# EAGLE design encoder_se (EAGLE 6.2)
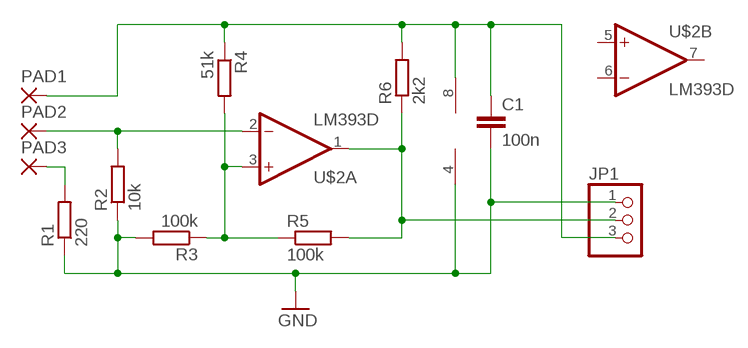
[diagram p0: schematic, sheet 1]

## Parts
C1  100n  C-EUC1206  [C1206]
JP1  PINHD-1X3/90  [1X03/90]
PAD1  SMD2  [SMD1,27-2,54]
PAD2  SMD2  [SMD1,27-2,54]
PAD3  SMD2  [SMD1,27-2,54]
R1  220  R-EU_M1206  [M1206]
R2  10k  R-EU_M1206  [M1206]
R3  100k  R-EU_M1206  [M1206]
R4  51k  R-EU_M1206  [M1206]
R5  100k  R-EU_M1206  [M1206]
R6  2k2  R-EU_M1206  [M1206]
U$2  LM393D  [SO08]

## Nets
GND: C1.2 JP1.1 R1.1 R2.1 R3.2 U$2.4(P:V-)
N$2: PAD3.1(P) R1.2
N$3: R3.1 R4.2 R5.1 U$2.3(A:+IN)
N$5: JP1.2 R5.2 R6.1 U$2.1(A:OUT)
N$6: PAD2.1(P) R2.2 U$2.2(A:-IN)
N$8: C1.1 JP1.3 PAD1.1(P) R4.1 R6.2 U$2.8(P:V+)
Unconnected: U$2.5(B:+IN) U$2.6(B:-IN) U$2.7(B:OUT)

## Library data of the parts
C1 = rcl:C-EU: CAPACITOR, European symbol
JP1 = pinhead:PINHD-1X3: PIN HEADER
PAD1-PAD3 = wirepad:SMD2: SMD PAD
R1-R6 = rcl:R-EU_: RESISTOR, European symbol
U$2 = linear:LM393: COMPARATOR

## Board
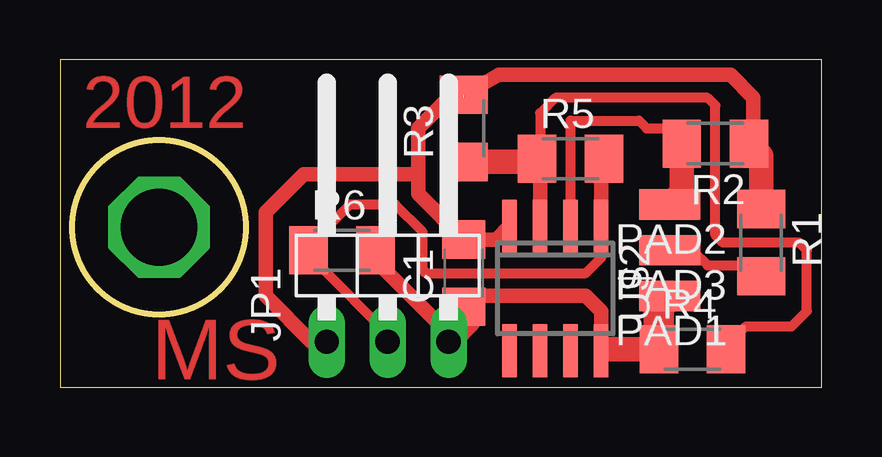
[diagram p1: board, top side]

Size 31.74 x 13.64 mm. Coordinates in mm from the lower left corner, seen from the top.
Outline: 0,0 31.74,0 31.74,13.64 0,13.64 0,0
Outline: circle at 4.13,6.67 radius 3.62
Copper layers (1*16): Top 0.035mm / dielectric 1.5mm / Bottom 0.035mm
Design rules: minimum track width 10mil, minimum drill 24mil, track to track 8mil, track to pad 8mil, pad to pad 8mil, via to via 8mil, smd to smd 8mil, copper to edge 40mil, drill to drill 8mil, minimum pad ring 10mil, minimum via ring 8mil, stop-mask expansion 4mil, vias tented up to drill 0mil, thermal gap 10mil

### Footprints (pad centres in the part's own frame; a part is rotated, then mirrored left to right if it is on the bottom)
C1206 = smd 1.6 x 1.8: 1 -1.4,0; 2 1.4,0
1X03/90 = drill 1.016 long: 1 -2.54,-3.81; 2 0,-3.81; 3 2.54,-3.81
SMD1,27-2,54 = smd 1.27 x 2.54: 1 0,0
M1206 = smd 1.6 x 2: 1 -1.4,0; 2 1.4,0
SO08 = smd 0.6 x 2.2: 1 -1.905,-2.6; 2 -0.635,-2.6; 3 0.635,-2.6; 4 1.905,-2.6; 5 1.905,2.6; 6 0.635,2.6; 7 -0.635,2.6; 8 -1.905,2.6

### Placement (x,y rotation side)
C1  16.83,4.76 90 top
JP1  13.65,5.71 0 top
PAD1  25.4,3.81 90 top
PAD2  25.4,7.62 90 top
PAD3  25.4,5.71 90 top
R1  29.21,6.03 270 top
R2  27.3,10.16 180 top
R3  16.83,10.79 90 top
R4  26.35,1.59 0 top
R5  21.27,9.53 0 top
R6  11.75,5.71 0 top
U$2  20.64,4.13 180 top

### Tracks (layer width: path | path; a pad name or v marks a point on that pad's centre or on a via)
GND  (1 unrouted)
  Top 0.61: U$2.4 18.17,6.16 C1.2 14.92,8.07 14.92,8.89 | R3.2 18.29,13.02 27.94,13.02 28.89,12.06 28.89,10.35 R2.1 | 14.92,8.89 14.92,10.79 16.51,12.38 16.83,12.06 | JP1.1 10.48,1.91 8.57,3.81 8.57,7.3 10.16,8.89 14.92,8.89
  Top 1.016: R1.1 29.21,9.65 R2.1
N$1  (via drill 3.2)
  other vias: 4.13,6.67
N$2
  Top 0.406: PAD3.1 26.35,5.71 26.99,5.08 28.76,5.08 R1.2
N$3
  Top 0.406: 20,9.65 20,11.43 20.64,12.06 26.99,12.06 27.31,11.75 27.31,6.35 27.62,6.03 30.8,6.03 31.12,5.71 31.12,3.17 30.48,2.54 28.57,2.54 27.75,1.72 R4.2
  Top 0.61: U$2.3 20,9.39 R5.1
  Top 0.813: 20,9.65 R5.1
  Top 1.016: R3.1 19.74,9.39 R5.1
N$5
  Top 0.406: U$2.1 22.54,5.4 21.91,4.76 15.24,4.76 15.11,4.89 15.11,6.48 13.97,7.62 12.06,7.62 10.79,6.35 10.79,6.16 R6.1 10.79,5.27 10.79,5.08 13.65,2.22 JP1.2
  Top 0.61: U$2.1 22.54,9.39 R5.2
N$6
  Top 0.406: U$2.2 21.27,11.11 24.13,11.11 24.45,10.79 25.27,10.79 R2.2
  Top 1.016: R2.2 25.9,8.12 PAD2.1
N$8
  Top 0.406: U$2.8 22.8,1.53 22.86,1.59
  Top 0.61: R6.2 13.15,5.27 15.88,2.54 15.88,2.22 JP1.3 | 16.83,2.86 16.83,3.17 17.46,3.81 21.91,3.81 22.54,3.17 U$2.8
  Top 1.016: 22.86,1.59 R4.1
  Top 1.27: R4.1 24.95,3.36 PAD1.1
  Top 1.422: JP1.3 16.19,2.22 16.83,2.86 C1.1

### Text on the board
Top: 2012 | MS